# EAGLE design RAMPS_1-3i (EAGLE 6.4)
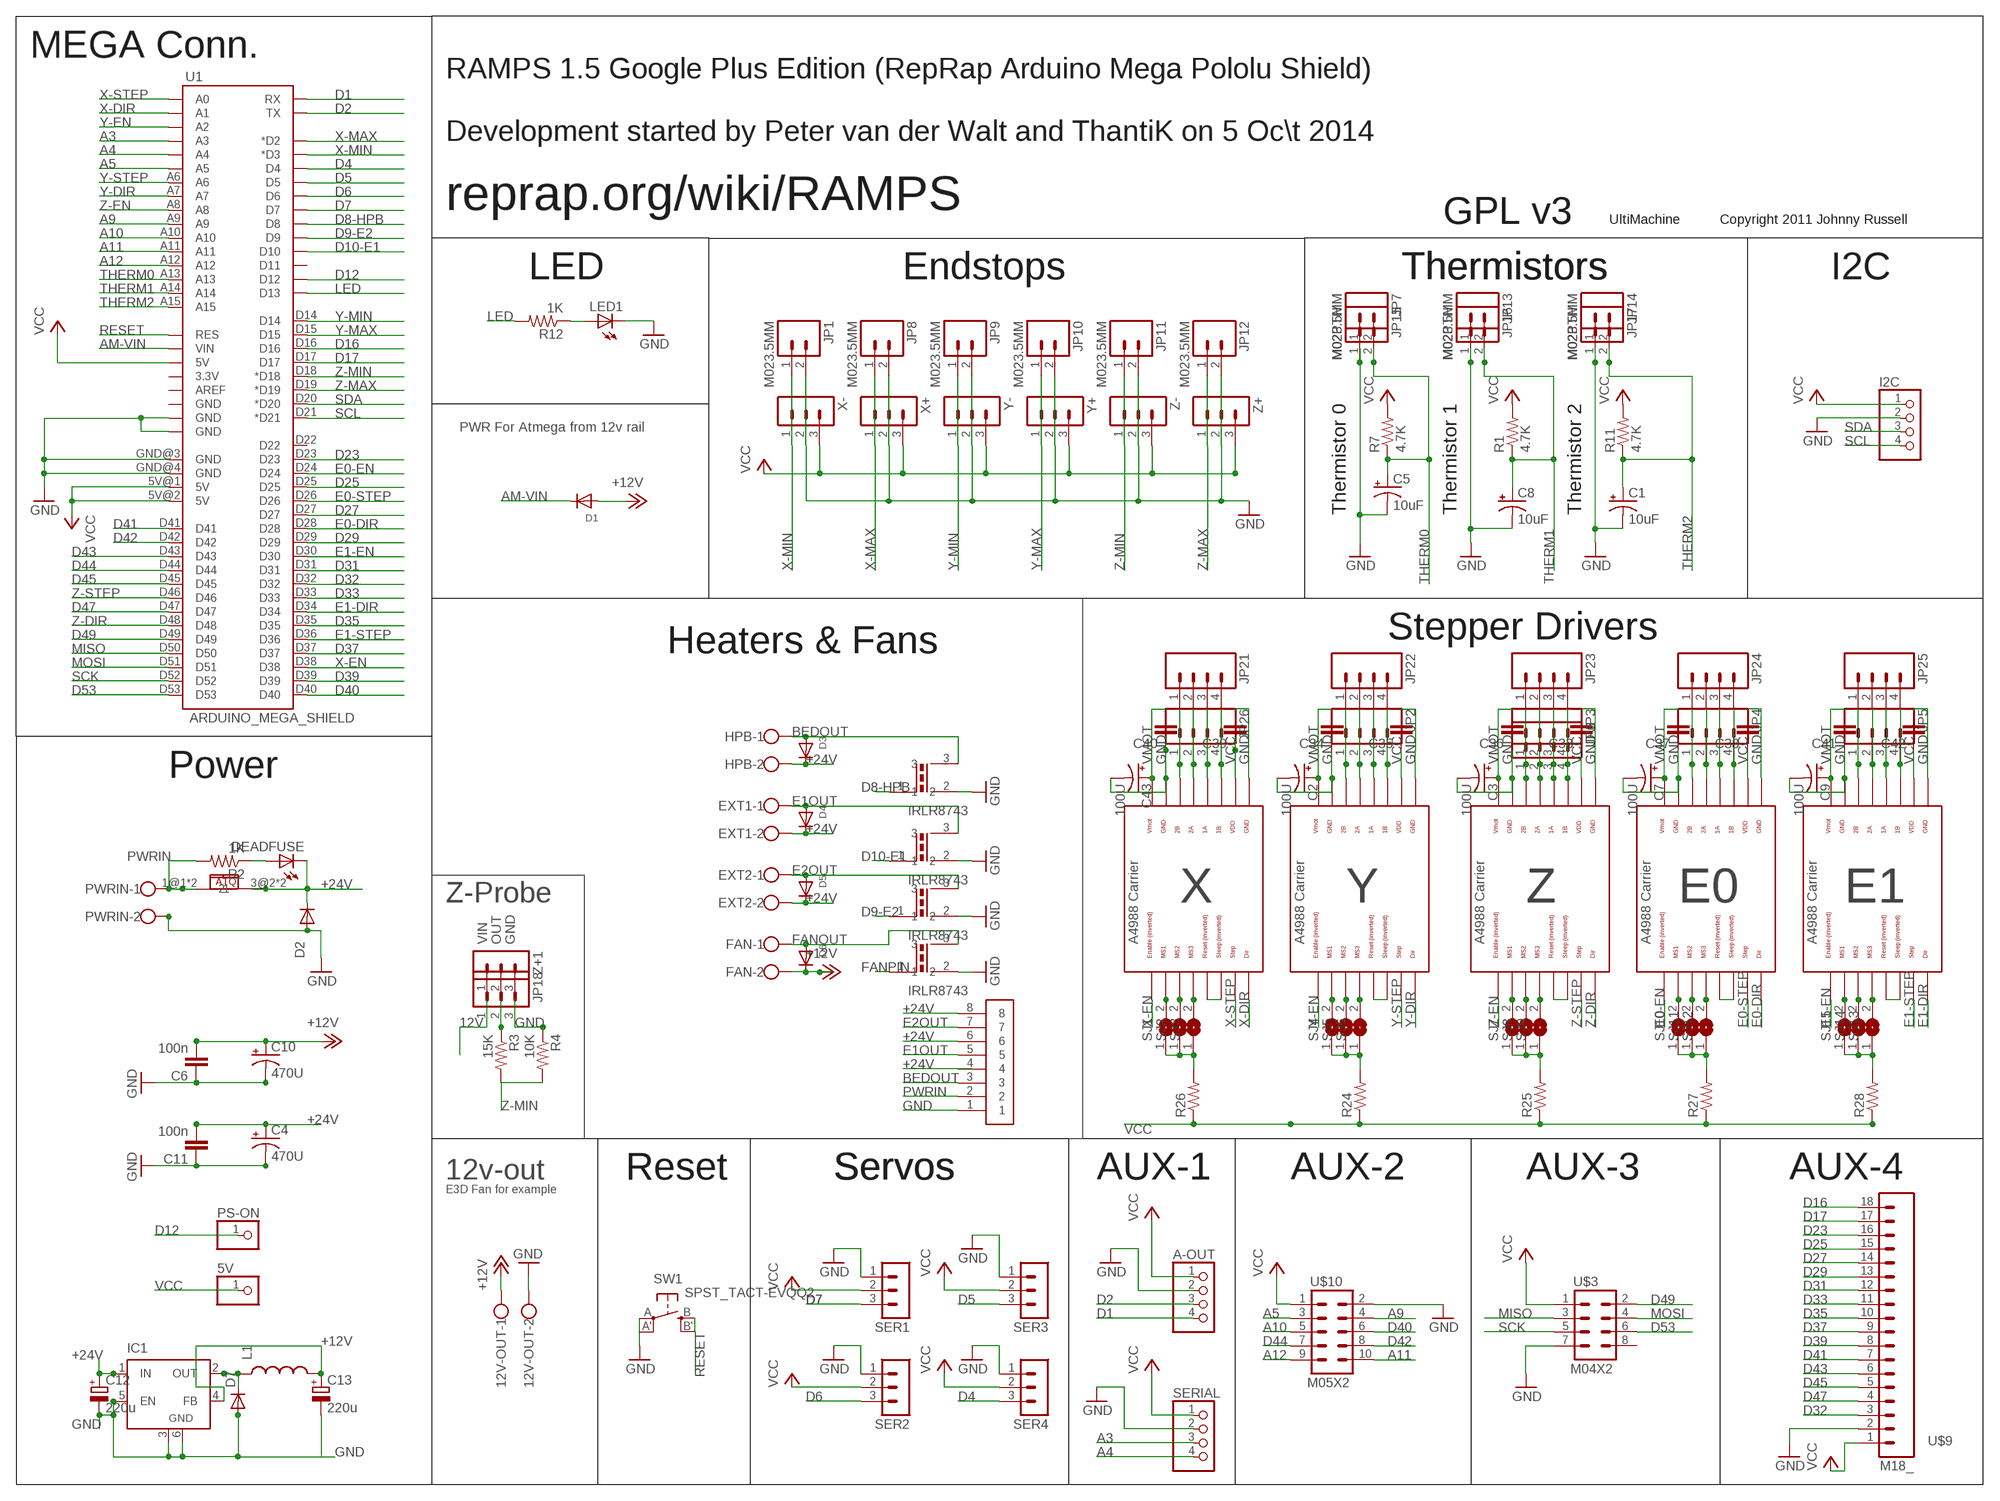
[diagram p0: schematic, sheet 1]

## Parts
5V  PINHD-1X1  [1X01]
12V-OUT  W237-102  [W237-102]
A-OUT  PINHD-1X4  [1X04]
C1  10uF  CPOL-USC  [PANASONIC_C]
C2  100U  CAP_POLD  [PANASONIC_D]
C3  100U  CAP_POLD  [PANASONIC_D]
C4  470U  CAP_POLD  [PANASONIC_D]
C5  10uF  CPOL-USC  [PANASONIC_C]
C6  100n  CAP1206  [1206]
C7  100U  CAP_POLD  [PANASONIC_D]
C8  10uF  CPOL-USC  [PANASONIC_C]
C9  100U  CAP_POLD  [PANASONIC_D]
C10  470U  CAP_POLD  [PANASONIC_D]
C11  100n  CAP1206  [1206]
C12  220u  CPOL-EU153CLV-0605  [153CLV-0605]
C13  220u  CPOL-EU153CLV-0605  [153CLV-0605]
C33  CAP1206  [1206]
C34  CAP1206  [1206]
C35  CAP1206  [1206]
C36  CAP1206  [1206]
C37  CAP1206  [1206]
C38  CAP1206  [1206]
C39  CAP1206  [1206]
C40  CAP1206  [1206]
C41  CAP1206  [1206]
C42  CAP1206  [1206]
C43  100U  CAP_POLD  [PANASONIC_D]
D1  DIODESMA  [SMADIODE]
D2  DIODESMA  [SMADIODE]
D3  DIODESMA  [SMADIODE]
D4  DIODESMA  [SMADIODE]
D5  DIODESMA  [SMADIODE]
D6  DIODESMA  [SMADIODE]
D7  DIODE-DO-214AC  [DO-214AC]
DEADFUSE  LEDCHIPLED_1206  [CHIPLED_1206]
E1POL1  POLOLU_A4983CARRIER  [A4988BREAKOUT]
E2POL1  POLOLU_A4983CARRIER  [A4988BREAKOUT]
EXT1  W237-102  [W237-102]
EXT2  W237-102  [W237-102]
FAN  W237-102  [W237-102]
HPB  W237-102  [W237-102]
I2C  PINHD-1X4  [1X04]
IC1  LM2596S  [TO263-5]
JP1  M023.5MM  [SCREWTERMINAL-3.5MM-2]
JP2  M04PTH  [1X04]
JP3  M04PTH  [1X04]
JP4  M04PTH  [1X04]
JP5  M04PTH  [1X04]
JP6  M04PTH  [1X04]
JP7  M023.5MM  [SCREWTERMINAL-3.5MM-2]
JP8  M023.5MM  [SCREWTERMINAL-3.5MM-2]
JP9  M023.5MM  [SCREWTERMINAL-3.5MM-2]
JP10  M023.5MM  [SCREWTERMINAL-3.5MM-2]
JP11  M023.5MM  [SCREWTERMINAL-3.5MM-2]
JP12  M023.5MM  [SCREWTERMINAL-3.5MM-2]
JP13  M023.5MM  [SCREWTERMINAL-3.5MM-2]
JP14  M023.5MM  [SCREWTERMINAL-3.5MM-2]
JP15  M02PTH  [1X02]
JP16  M02PTH  [1X02]
JP17  M02PTH  [1X02]
JP18  M03SCREW_LOCK  [SCREWTERMINAL-3.5MM-3_LOCK.007S]
JP21  M04SCREW  [SCREWTERMINAL-3.5MM-4]
JP22  M04SCREW  [SCREWTERMINAL-3.5MM-4]
JP23  M04SCREW  [SCREWTERMINAL-3.5MM-4]
JP24  M04SCREW  [SCREWTERMINAL-3.5MM-4]
JP25  M04SCREW  [SCREWTERMINAL-3.5MM-4]
JP26  M04PTH  [1X04]
L1  INDUCTORPWR  [CDRH125]
LED1  LED3MM  [LED3MM]
PS-ON  PINHD-1X1  [1X01]
PWRIN  W237-102  [W237-102]
R1  4.7K  R-US_M1206  [M1206]
R2  1K  R-US_M1206  [M1206]
R3  15K  R-US_M1206  [M1206]
R4  10K  R-US_M1206  [M1206]
R7  4.7K  R-US_M1206  [M1206]
R11  4.7K  R-US_M1206  [M1206]
R12  1K  R-US_M1206  [M1206]
R24  RESISTOR1206  [1206]
R25  RESISTOR1206  [1206]
R26  RESISTOR1206  [1206]
R27  RESISTOR1206  [1206]
R28  RESISTOR1206  [1206]
SER1  3PIN-HEADER  [3PIN-HEADER]
SER2  3PIN-HEADER  [3PIN-HEADER]
SER3  3PIN-HEADER  [3PIN-HEADER]
SER4  3PIN-HEADER  [3PIN-HEADER]
SERIAL  PINHD-1X4  [1X04]
SJ1  SJ  [SJ]
SJ2  SJ  [SJ]
SJ3  SJ  [SJ]
SJ4  SJ  [SJ]
SJ5  SJ  [SJ]
SJ6  SJ  [SJ]
SJ7  SJ  [SJ]
SJ8  SJ  [SJ]
SJ9  SJ  [SJ]
SJ10  SJ  [SJ]
SJ11  SJ  [SJ]
SJ12  SJ  [SJ]
SJ13  SJ  [SJ]
SJ14  SJ  [SJ]
SJ15  SJ  [SJ]
SW1  SPST_TACT-EVQQ2  [EVQ-Q2]
U1  ARDUINO_MEGA_SHIELD  [ARDUINO_MEGA_SHIELD]
U$1  IRLR8743  [TO263]
U$2  IRLR8743  [TO263]
U$3  M04X2  [2X4]
U$4  XY825A-8P  [XY825A-8P]
U$5  CQ-121  [CQ121]
U$9  M18_  [1X18]
U$10  M05X2  [2X5]
U$11  IRLR8743  [TO263]
U$12  IRLR8743  [TO263]
X+  3PIN-HEADER  [3PIN-HEADER]
X-  3PIN-HEADER  [3PIN-HEADER]
XPOL1  POLOLU_A4983CARRIER  [A4988BREAKOUT]
Y+  3PIN-HEADER  [3PIN-HEADER]
Y-  3PIN-HEADER  [3PIN-HEADER]
YPOL1  POLOLU_A4983CARRIER  [A4988BREAKOUT]
Z+  3PIN-HEADER  [3PIN-HEADER]
Z+1  3PIN-HEADER  [3PIN-HEADER]
Z-  3PIN-HEADER  [3PIN-HEADER]
ZPOL1  POLOLU_A4983CARRIER  [A4988BREAKOUT]

## Nets
12V: JP18.1 Z+1.1
+12V: 12V-OUT.1 C6.2 C10.+ C13.+ D1.A D6.C FAN.2 IC1.4(FB) L1.2
+24V: C4.+ C11.2 C12.+ D2.C D3.C D4.C D5.C DEADFUSE.C EXT1.2 EXT2.2 HPB.2 IC1.1(IN) U$4.6 U$4.8 U$5.3@2 U$5.4@2
A3: SERIAL.3 U1.A3
A4: SERIAL.4 U1.A4
A5: U1.A5 U$10.3
A9: U1.A9 U$10.4
A10: U1.A10 U$10.5
A11: U1.A11 U$10.10
A12: U1.A12 U$10.9
AM-VIN: D1.C U1.VIN
BEDOUT: D3.A HPB.1 U$2.3 U$4.3
D1: A-OUT.4 U1.RX
D2: A-OUT.3 U1.TX
D4: SER4.3 U1.D4
D5: SER3.3 U1.D5
D6: SER2.3 U1.D6
D7: SER1.3 U1.D7
D8-HPB: U1.D8 U$2.1
D9-E2: U1.D9 U$11.1
D10-E1: U1.D10 U$12.1
D12: PS-ON.1 U1.D12
D16: U1.D16 U$9.18
D17: U1.D17 U$9.17
D23: U1.D23 U$9.16
D25: U1.D25 U$9.15
D27: U1.D27 U$9.14
D29: U1.D29 U$9.13
D31: U1.D31 U$9.12
D32: U1.D32 U$9.3
D33: U1.D33 U$9.11
D35: U1.D35 U$9.10
D37: U1.D37 U$9.9
D39: U1.D39 U$9.8
D40: U1.D40 U$10.6
D41: U1.D41 U$9.7
D42: U1.D42 U$10.8
D43: U1.D43 U$9.6
D44: U1.D44 U$10.7
D45: U1.D45 U$9.5
D47: U1.D47 U$9.4
D49: U1.D49 U$3.2
D53: U1.D53 U$3.6
E0-DIR: E1POL1.DIR U1.D28
E0-EN: E1POL1.EN U1.D24
E0-STEP: E1POL1.STEP U1.D26
E1-DIR: E2POL1.DIR U1.D34
E1-EN: E2POL1.EN U1.D30
E1-STEP: E2POL1.STEP U1.D36
E1OUT: D4.A EXT1.1 U$4.5 U$12.3
E2OUT: D5.A EXT2.1 U$4.7 U$11.3
FANOUT: D6.A FAN.1 U$1.3
FANPIN: U$1.1
GND: 12V-OUT.2 A-OUT.2 C1.- C2.- C3.- C4.- C5.- C6.1 C7.- C8.- C9.- C10.- C11.1 C12.- C13.- C33.2 C34.1 C35.2 C36.1 C37.1 C38.2 C39.2 C40.1 C41.1 C42.2 C43.- D2.A D7.2(A) E1POL1.GND E1POL1.GND@0(GND) E2POL1.GND E2POL1.GND@0(GND) I2C.2 IC1.3(GND) IC1.5(EN) IC1.6(GND) JP1.2 JP7.1 JP8.2 JP9.2 JP10.2 JP11.2 JP12.2 JP13.1 JP14.1 JP15.1 JP16.1 JP17.1 JP18.3 LED1.K(C) PWRIN.2 R4.1 SER1.1 SER2.1 SER3.1 SER4.1 SERIAL.2 SW1.A'(P1) SW1.A(P) U1.GND@0(GND) U1.GND@1(GND) U1.GND@3(GND) U1.GND@4(GND) U$1.2 U$2.2 U$3.7 U$4.1 U$9.2 U$10.2 U$11.2 U$12.2 X+.2 X-.2 XPOL1.GND XPOL1.GND@0(GND) Y+.2 Y-.2 YPOL1.GND YPOL1.GND@0(GND) Z+1.3 Z+.2 Z-.2 ZPOL1.GND ZPOL1.GND@0(GND)
LED: R12.2 U1.D13
MISO: U1.D50 U$3.3
MOSI: U1.D51 U$3.4
N$1: D7.1(C) IC1.2(OUT) L1.1
N$3: DEADFUSE.A R2.1
N$4: SJ2.2 XPOL1.MS2
N$6: SJ1.2 XPOL1.MS1
N$7: SJ4.2 YPOL1.MS1
N$8: SJ5.2 YPOL1.MS2
N$9: SJ7.2 ZPOL1.MS1
N$10: SJ8.2 ZPOL1.MS2
N$11: SJ9.2 ZPOL1.MS3
N$12: SJ6.2 YPOL1.MS3
N$13: SJ3.2 XPOL1.MS3
N$14: E2POL1.MS2 SJ14.2
N$15: E2POL1.MS3 SJ13.2
N$16: E2POL1.MS1 SJ15.2
N$17: E1POL1.MS3 SJ12.2
N$18: E1POL1.MS1 SJ10.2
N$19: E1POL1.MS2 SJ11.2
N$46: LED1.A R12.1
N$52: E1POL1.RST E1POL1.SLP(SLEEP)
N$53: ZPOL1.RST ZPOL1.SLP(SLEEP)
N$56: YPOL1.RST YPOL1.SLP(SLEEP)
N$57: XPOL1.RST XPOL1.SLP(SLEEP)
N$58: R26.2 SJ1.1 SJ2.1 SJ3.1
N$59: R24.2 SJ4.1 SJ5.1 SJ6.1
N$60: R27.2 SJ10.1 SJ11.1 SJ12.1
N$62: R25.2 SJ7.1 SJ8.1 SJ9.1
N$63: E1POL1.1B JP4.4 JP24.4
N$65: E1POL1.1A JP4.3 JP24.3
N$68: E1POL1.2A JP4.2 JP24.2
N$69: E1POL1.2B JP4.1 JP24.1
N$70: JP3.4 JP6.4 JP23.4 ZPOL1.1B
N$71: JP3.3 JP6.3 JP23.3 ZPOL1.1A
N$72: JP3.2 JP6.2 JP23.2 ZPOL1.2A
N$74: JP3.1 JP6.1 JP23.1 ZPOL1.2B
N$75: JP2.1 JP22.1 YPOL1.2B
N$76: JP2.2 JP22.2 YPOL1.2A
N$77: JP2.3 JP22.3 YPOL1.1A
N$78: JP2.4 JP22.4 YPOL1.1B
N$79: JP21.4 JP26.4 XPOL1.1B
N$80: JP21.3 JP26.3 XPOL1.1A
N$81: JP21.2 JP26.2 XPOL1.2A
N$82: JP21.1 JP26.1 XPOL1.2B
N$83: E2POL1.RST E2POL1.SLP(SLEEP)
N$84: R28.2 SJ13.1 SJ14.1 SJ15.1
N$85: E2POL1.1B JP5.4 JP25.4
N$86: E2POL1.1A JP5.3 JP25.3
N$87: E2POL1.2A JP5.2 JP25.2
N$88: E2POL1.2B JP5.1 JP25.1
PWRIN: PWRIN.1 R2.2 U$4.2 U$5.1@1 U$5.2@1
RESET: SW1.B'(S1) SW1.B(S) U1.RES
SCK: U1.D52 U$3.5
SCL: I2C.4 U1.D21(*D21)
SDA: I2C.3 U1.D20(*D20)
SENSOROUT: JP18.2 R3.1 Z+1.2
THERM0: C5.+ JP7.2 JP15.2 R7.1 U1.A13
THERM1: C8.+ JP13.2 JP16.2 R1.1 U1.A14
THERM2: C1.+ JP14.2 JP17.2 R11.1 U1.A15
VCC: 5V.1 A-OUT.1 C33.1 C35.1 C38.1 C39.1 C42.1 E1POL1.VDD E2POL1.VDD I2C.1 R1.2 R7.2 R11.2 R24.1 R25.1 R26.1 R27.1 R28.1 SER1.2 SER2.2 SER3.2 SER4.2 SERIAL.1 U1.5V@0(5V) U1.5V@1(5V) U1.5V@2(5V) U$3.1 U$9.1 U$10.1 X+.3 X-.3 XPOL1.VDD Y+.3 Y-.3 YPOL1.VDD Z+.3 Z-.3 ZPOL1.VDD
VMOT: C2.+ C3.+ C7.+ C9.+ C34.2 C36.2 C37.2 C40.2 C41.2 C43.+ E1POL1.VMOT E2POL1.VMOT XPOL1.VMOT YPOL1.VMOT ZPOL1.VMOT
X-DIR: U1.A1 XPOL1.DIR
X-EN: U1.D38 XPOL1.EN
X-MAX: JP8.1 U1.D2(*D2) X+.1
X-MIN: JP1.1 U1.D3(*D3) X-.1
X-STEP: U1.A0 XPOL1.STEP
Y-DIR: U1.A7 YPOL1.DIR
Y-EN: U1.A2 YPOL1.EN
Y-MAX: JP10.1 U1.D15 Y+.1
Y-MIN: JP9.1 U1.D14 Y-.1
Y-STEP: U1.A6 YPOL1.STEP
Z-DIR: U1.D48 ZPOL1.DIR
Z-EN: U1.A8 ZPOL1.EN
Z-MAX: JP12.1 U1.D19(*D19) Z+.1
Z-MIN: JP11.1 R3.2 R4.2 U1.D18(*D18) Z-.1
Z-STEP: U1.D46 ZPOL1.STEP
Unconnected: U1.3.3V U1.AREF U1.D11 U1.D22 U1.GND@2(GND) U$3.8 U$4.4

## Notes on the sheet
- MEGA Conn.
- RAMPS 1.5 Google Plus Edition (RepRap Arduino Mega Pololu Shield)
  
  Development started by Peter van der Walt and ThantiK on 5 Oc\t 2014
- reprap.org/wiki/RAMPS
- GPL v3 | UltiMachine | Copyright 2011 Johnny Russell
- LED | Endstops | Thermistors | Thermistors | I2C
- PWR For Atmega from 12v rail
- Thermistor 0 | Thermistor 1 | Thermistor 2
- Stepper Drivers
- Heaters & Fans
- Power
- Z-Probe | X | Y | Z | E0 | E1
- VIN | OUT | GND
- 12v-out | Reset | Servos | Servos | AUX-1 | AUX-2 | AUX-3 | AUX-4
- E3D Fan for example

## Library data of the parts
5V PS-ON = adafruit:PINHD-1X1: Pin header 1x1 for 0.1" spacing With round pins
12V-OUT EXT1 EXT2 FAN HPB PWRIN = con-wago-500:W237-102: WAGO SCREW CLAMP; MPN: 237-102; OC_FARNELL: unknown; OC_NEWARK: 70K9898
A-OUT I2C SERIAL = RepRapjr:PINHD-1X4: PIN HEADER
C1 C5 C8 = adafruit:CPOL-US: POLARIZED CAPACITOR, American symbol
C2-C4 C7 C9 C10 C43 = SparkFun-Capacitors:CAP_POL: Capacitor Polarized These are standard SMD and PTH capacitors. Normally 10uF, 47uF, and 100uF in electrolytic and tantalum varieties. Always verify the external diameter of the through hole cap, it varies with capacity, voltage, and manufacturer. The EIA devices should be standard.
C6 C11 C33-C42 = SparkFun-Passives:CAP: Capacitor Standard 0603 ceramic capacitor, and 0.1" leaded capacitor.
C12 C13 = rcl:CPOL-EU: POLARIZED CAPACITOR, European symbol
D1-D6 = adafruit:DIODE: Diode SMADIODE - SMA Surface Mount Package 20V 1A Schottky Diode Digikey: 641-1014-6-ND DO-1N4148 - Through Hole Small Current Diode SOD-123 20V 1 A (.5mV Vf) Schottky Diode - Digikey: MBRX120TPMSCT-ND SOD-323 10V 570mA (.38mV Vf, 3ns) Schottky Diode - Digikey: ZLLS410CT-ND SOD-523 30V 30mA Schottky Diode (RB751S-40TE61) - Digikey: RB751S-40TE61CT-ND SOT23-R/W - SOT23 Package (R = Solder Paste/Reflow Ovens, W = Hand-Soldering) BAT54Film 40V 300mA - Digikey: 497-7162-1-ND
D7 = dp_devices:DIODE: Various Diode Packages
DEADFUSE LED1 = led:LED: LED OSRAM: - CHIPLED LG R971, LG N971, LY N971, LG Q971, LY Q971, LO R971, LY R971 LH N974, LH R974 LS Q976, LO Q976, LY Q976 LO Q996 - Hyper CHIPLED LW Q18S LB Q993, LB Q99A, LB R99A - SideLED LS A670, LO A670, LY A670, LG A670, LP A670 LB A673, LV A673, LT A673, LW A673 LH A674 LY A675 LS A676, LA A676, LO A676, LY A676, LW A676 LS A679, LY A679, LG A679 - Hyper Micro SIDELED® LS Y876, LA Y876, LO Y876, LY Y876 LT Y87S - SmartLED LW L88C, LW L88S LB L89C, LB L89S, LG L890 LS L89K, LO L89K, LY L89K LS L896, LA L896, LO L896, LY L896 - TOPLED LS T670, LO T670, LY T670, LG T670, LP T670 LSG T670, LSP T670, LSY T670, LOP T670, LYG T670 LG T671, LOG T671, LSG T671 LB T673, LV T673, LT T673, LW T673 LH T674 LS T676, LA T676, LO T676, LY T676, LB T676, LH T676, LSB T676, LW T676 LB T67C, LV T67C, LT T67C, LS T67K, LO T67K, LY T67K, LW E67C LS E67B, LA E67B, LO E67B, LY E67B, LB E67C, LV E67C, LT E67C LW T67C LS T679, LY T679, LG T679 LS T770, LO T770, LY T770, LG T770, LP T770 LB T773, LV T773, LT T773, LW T773 LH T774 LS E675, LA E675, LY E675, LS T675 LS T776, LA T776, LO T776, LY T776, LB T776 LHGB T686 LT T68C, LB T68C - Hyper Mini TOPLED® LB M676 - Mini TOPLED Santana® LG M470 LS M47K, LO M47K, LY M47K Source: http://www.osram.convergy.de LUXEON: - LUMILED® LXK2-PW12-R00, LXK2-PW12-S00, LXK2-PW14-U00, LXK2-PW14-V00 LXK2-PM12-R00, LXK2-PM12-S00, LXK2-PM14-U00 LXK2-PE12-Q00, LXK2-PE12-R00, LXK2-PE12-S00, LXK2-PE14-T00, LXK2-PE14-U00 LXK2-PB12-K00, LXK2-PB12-L00, LXK2-PB12-M00, LXK2-PB14-N00, LXK2-PB14-P00, LXK2-PB14-Q00 LXK2-PR12-L00, LXK2-PR12-M00, LXK2-PR14-Q00, LXK2-PR14-R00 LXK2-PD12-Q00, LXK2-PD12-R00, LXK2-PD12-S00 LXK2-PH12-R00, LXK2-PH12-S00 LXK2-PL12-P00, LXK2-PL12-Q00, LXK2-PL12-R00 Source: www.luxeon.com KINGBRIGHT: KA-3528ASYC Source: www.kingbright.com
E1POL1 E2POL1 XPOL1 YPOL1 ZPOL1 = RepRapjr:POLOLU_A4983CARRIER
IC1 = linear:LM2596S: STEP-DOWN VOLTAGE REGULATOR
JP1 JP7-JP17 = SparkFun-Connectors:M02: Standard 2-pin 0.1" header. Use with - straight break away headers ( PRT-00116) - right angle break away headers (PRT-00553) - swiss pins (PRT-00743) - machine pins (PRT-00117) - female headers (PRT-00115) Molex polarized connector foot print use with: PRT-08233 with associated crimp pins and housings. 2.54_SCREWTERM for use with PRT-10571. 3.5mm Screw Terminal footprints for PRT-08084 5mm Screw Terminal footprints for use with PRT-08432
JP2-JP6 JP21-JP26 = SparkFun-Connectors:M04: Header 4 Standard 4-pin 0.1" header. Use with straight break away headers (SKU : PRT-00116), right angle break away headers (PRT-00553), swiss pins (PRT-00743), machine pins (PRT-00117), and female headers (PRT-00115). Molex polarized connector foot print use with SKU : PRT-08231 with associated crimp pins and housings. 1MM SMD Version SKU: PRT-10208
JP18 = SparkFun-Connectors:M03: Header 3 Standard 3-pin 0.1" header. Use with straight break away headers (SKU : PRT-00116), right angle break away headers (PRT-00553), swiss pins (PRT-00743), machine pins (PRT-00117), and female headers (PRT-00115). Molex polarized connector foot print use with SKU : PRT-08232 with associated crimp pins and housings.
L1 = SparkFun-Passives:INDUCTOR: Inductors Basic Inductor/Choke - 0603 and 1206. Footprints are not proven and vary greatly between part numbers. SRN6045- 33uH, 20% 1.4A SDR0403-560KL - 56uH, 10%, 500mA RMS/740mA peak
R1-R4 R7 R11 R12 = adafruit:R-US_: RESISTOR, American symbol
R24-R28 = SparkFun-Passives:RESISTOR: Resistor Basic schematic elements and footprints for 0603, 1206, and PTH resistors.
SER1-SER4 X+ X- Y+ Y- Z+ Z+1 Z- = ultimachine:3PIN-HEADER: PIN HEADER
SJ1-SJ15 = jumper:SJ: SMD solder JUMPER
SW1 = adafruit:SPST_TACT: SMT 6mm switch, EVQQ2 series http://www.ladyada.net/library/eagle
U1 = RepRapjr:ARDUINO_MEGA_SHIELD
U$1 U$2 U$11 U$12 = IRLR8743:IRLR8743
U$3 = SparkFun:M04X2
U$4 = Communica.co.za:XY825A-8P
U$5 = Mantech.co.za:CQ-121
U$9 = SparkFun:M18
U$10 = RepRapjr:M05X2

## Net classes
0 default: width 0.254 mm, clearance 0.254 mm

## Board
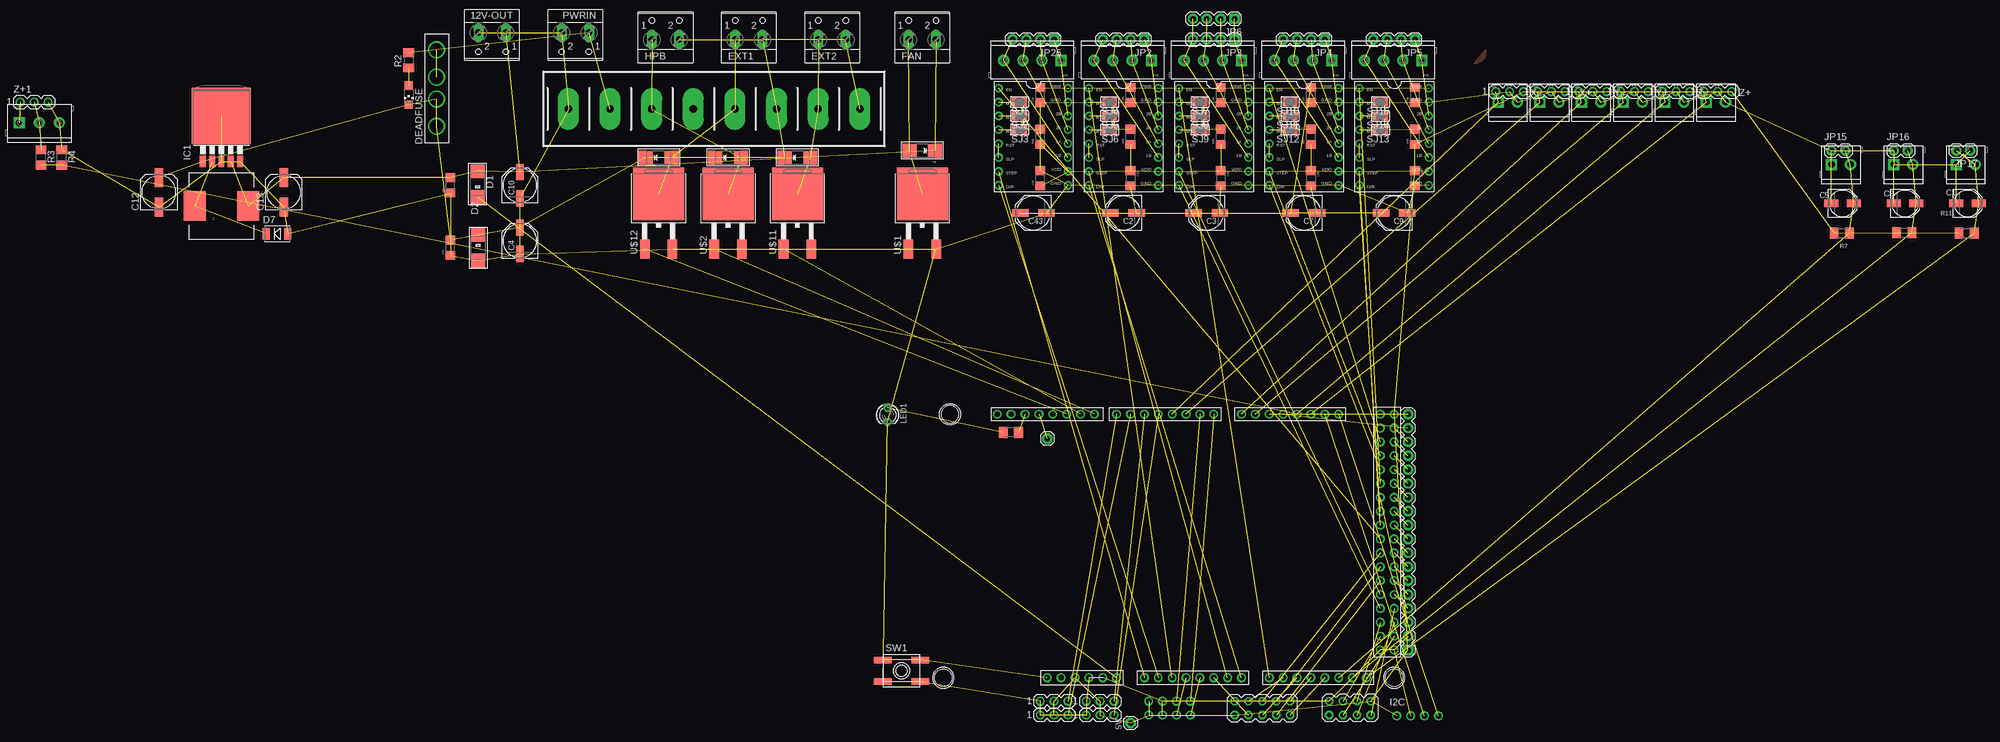
[diagram p1: board, top side]
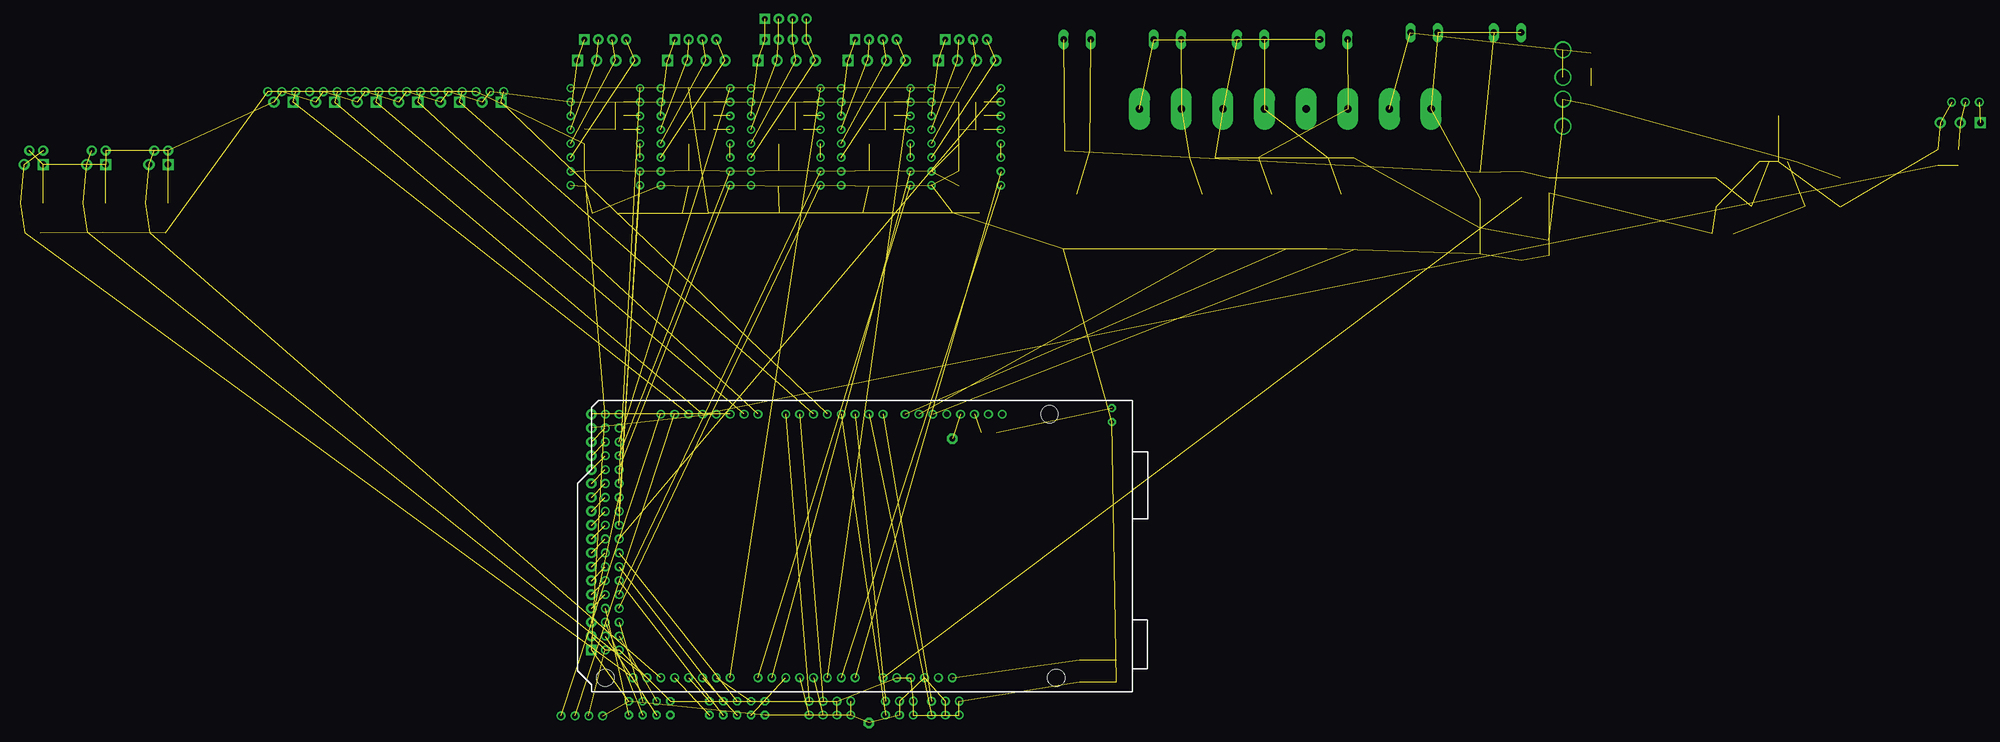
[diagram p2: board, bottom side, seen from below]

No outline drawn. Coordinates in mm, seen from the top.
Copper layers (1*16): Top 0.035mm / dielectric 1.5mm / Bottom 0.035mm
Design rules "ramps1-3 *": minimum track width 7mil, minimum drill 15mil, track to track 7mil, track to pad 7mil, pad to pad 7mil, via to via 7mil, smd to smd 7mil, copper to edge 10mil, drill to drill 8mil, minimum pad ring 12mil, minimum via ring 12mil, stop-mask expansion 4mil, vias tented up to drill 25mil, thermal gap 10mil

### Footprints (pad centres in the part's own frame; a part is rotated, then mirrored left to right if it is on the bottom)
1X01 = drill 1.016 pad 1.93 octagon: 1 0,0
W237-102 = drill 1.194 long: 1 -2.5,-1.27; 2 2.5,-1.27
1X04 = drill 1.016: 1 -2.54,0; 2 0,0; 3 2.54,0; 4 5.08,0
PANASONIC_C = smd 2.6 x 1.4: + 2.05,0; - -2.05,0
PANASONIC_D = smd 3 x 1.4: + 2.4,0; - -2.4,0
1206 = smd 1.6 x 1.8: 1 -1.4,0; 2 1.4,0
153CLV-0605 = smd 3.5 x 1.6: + 2.7,0; - -2.7,0
SMADIODE = smd 2.54 x 2.54: A 2.349,0; C -2.349,0
DO-214AC = smd 1.27 x 2.1: 1 -1.98,0; 2 1.98,0
CHIPLED_1206 = smd 1.5 x 1.5: A 0,-1.75; C 0,1.75
A4988BREAKOUT = drill 0.9: 1A 8.89,1.27; 1B 11.43,1.27; 2A 6.35,1.27; 2B 3.81,1.27; DIR 16.51,-11.43; EN -1.27,-11.43; GND 16.51,1.27; GND@0 1.27,1.27; MS1 1.27,-11.43; MS2 3.81,-11.43; MS3 6.35,-11.43; RST 8.89,-11.43; SLP 11.43,-11.43; STEP 13.97,-11.43; VDD 13.97,1.27; VMOT -1.27,1.27
TO263-5 = smd 1.067 x 2.159: 1 -3.404,-5.791; 2 -1.702,-5.791; 3 0,-5.791; 4 1.702,-5.791; 5 3.404,-5.791 | smd 10.8 x 10.41: 6 0,2.54
SCREWTERMINAL-3.5MM-2 = drill 1.2 pad 2.032 square: 1 0,0 | drill 1.2 pad 2.032: 2 3.5,0
1X04' = drill 1.016 pad 1.88 square: 1 0,0 | drill 1.016 pad 1.88: 2 2.54,0; 3 5.08,0; 4 7.62,0
1X02 = drill 1.016 pad 1.88: 1 0,0; 2 2.54,0
SCREWTERMINAL-3.5MM-3_LOCK.007S = drill 1.2 pad 2.032 square: 1 -0.178,0 | drill 1.2 pad 2.032: 2 3.5,0; 3 7.178,0
SCREWTERMINAL-3.5MM-4 = drill 1.2 pad 2.032 square: 1 0,0 | drill 1.2 pad 2.032: 2 3.5,0; 3 7,0; 4 10.5,0
CDRH125 = smd 5.4 x 4: 1 0,4.9; 2 0,-4.9
LED3MM = drill 0.813 octagon: A -1.27,0; K 1.27,0
M1206 = smd 1.6 x 2: 1 -1.4,0; 2 1.4,0
3PIN-HEADER = drill 1.016: 1 -2.54,0; 2 0,0; 3 2.54,0
SJ = smd 1.168 x 1.6: 1 -0.762,0; 2 0.762,0
EVQ-Q2 = smd 3.2 x 1.2: A -3.4,-2; A' 3.4,-2; B -3.4,2; B' 3.4,2
ARDUINO_MEGA_SHIELD = drill 1 pad 1.422: 3.3V 35.56,2.54; 5V@0 38.1,2.54; 5V@1 93.98,50.8; 5V@2 96.52,50.8; A0 50.8,2.54; A1 53.34,2.54; A2 55.88,2.54; A3 58.42,2.54; A4 60.96,2.54; A5 63.5,2.54; A6 66.04,2.54; A7 68.58,2.54; A8 73.66,2.54; A9 76.2,2.54; A10 78.74,2.54; A11 81.28,2.54; A12 83.82,2.54; A13 86.36,2.54; A14 88.9,2.54; A15 91.44,2.54; AREF 23.876,50.8; D2 58.42,50.8; D3 55.88,50.8; D4 53.34,50.8; D5 50.8,50.8; D6 48.26,50.8; D7 45.72,50.8; D8 41.656,50.8; D9 39.116,50.8; D10 36.576,50.8; D11 34.036,50.8; D12 31.496,50.8; D13 28.956,50.8; D14 68.58,50.8; D15 71.12,50.8; D16 73.66,50.8; D17 76.2,50.8; D18 78.74,50.8; D19 81.28,50.8; D20 83.82,50.8; D21 86.36,50.8; D22 93.98,48.26; D23 96.52,48.26; D24 93.98,45.72; D25 96.52,45.72; D26 93.98,43.18; D27 96.52,43.18; D28 93.98,40.64; D29 96.52,40.64; D30 93.98,38.1; D31 96.52,38.1; D32 93.98,35.56; D33 96.52,35.56; D34 93.98,33.02; D35 96.52,33.02; D36 93.98,30.48; D37 96.52,30.48; D38 93.98,27.94; D39 96.52,27.94; D40 93.98,25.4; D41 96.52,25.4; D42 93.98,22.86; D43 96.52,22.86; D44 93.98,20.32; D45 96.52,20.32; D46 93.98,17.78; D47 96.52,17.78; D48 93.98,15.24; D49 96.52,15.24; D50 93.98,12.7; D51 96.52,12.7; D52 93.98,10.16; D53 96.52,10.16; GND@0 40.64,2.54; GND@1 43.18,2.54; GND@2 26.416,50.8; GND@3 93.98,7.62; GND@4 96.52,7.62; RES 33.02,2.54; RX 63.5,50.8; TX 60.96,50.8; VIN 45.72,2.54 | hole 3.2: 96.52,2.54; 13.97,2.54; 15.24,50.8
TO263 = smd 1.762 x 3.4: 1 -2.54,-6.6; 2 2.54,-6.6 | smd 9.34 x 9.6: 3 0,3.5
2X4 = drill 0.9 pad 1.422 octagon: 1 -3.81,-1.27; 2 -3.81,1.27; 3 -1.27,-1.27; 4 -1.27,1.27; 5 1.27,-1.27; 6 1.27,1.27; 7 3.81,-1.27; 8 3.81,1.27
XY825A-8P = drill 1.3 pad 3.81 long: 1 -26.67,0; 2 -19.05,0; 3 -11.43,0; 4 -3.81,0; 5 3.81,0; 6 11.43,0; 7 19.05,0; 8 26.67,0
CQ121 = drill 2.5: 1@1 -7,0; 2@1 -2,0; 3@2 2,0; 4@2 7,0
1X18 = drill 1.016 pad 1.88 square: 1 0,0 | drill 1.016 pad 1.88: 2 2.54,0; 3 5.08,0; 4 7.62,0; 5 10.16,0; 6 12.7,0; 7 15.24,0; 8 17.78,0; 9 20.32,0; 10 22.86,0; 11 25.4,0; 12 27.94,0; 13 30.48,0; 14 33.02,0; 15 35.56,0; 16 38.1,0; 17 40.64,0; 18 43.18,0
2X5 = drill 0.9 pad 1.422 octagon: 1 -3.81,-1.27; 2 -3.81,1.27; 3 -1.27,-1.27; 4 -1.27,1.27; 5 1.27,-1.27; 6 1.27,1.27; 7 3.81,-1.27; 8 3.81,1.27; 9 6.35,-1.27; 10 6.35,1.27

### Placement (x,y rotation side)
5V  -66.04,8.23 0 top
12V-OUT  -182.88,133.35 180 top
A-OUT  -60.17,12.22 0 top
C1  87.15,103.38 0 top
C2  -67.31,101.6 180 top
C3  -52.07,101.6 180 top
C4  -177.8,96.52 90 top
C5  64.29,103.38 0 top
C6  -190.5,106.68 90 top
C7  -34.29,101.6 180 top
C8  75.72,103.38 0 top
C9  -17.78,101.6 180 top
C10  -177.8,106.68 90 top
C11  -190.5,95.25 90 top
C12  -243.84,105.41 90 top
C13  -220.98,105.41 90 top
C33  -49.53,107.95 270 top
C34  -66.04,123.19 90 top
C35  -66.04,107.95 270 top
C36  -13.97,123.19 90 top
C37  -33.02,123.19 90 top
C38  -13.97,107.95 270 top
C39  -33.02,107.95 270 top
C40  -49.53,123.19 90 top
C41  -82.55,123.19 90 top
C42  -82.55,107.95 90 top
C43  -83.82,101.6 180 top
D1  -185.53,106.88 90 top
D2  -185.42,95.25 270 top
D3  -139.7,111.76 0 top
D4  -152.4,111.76 0 top
D5  -127,111.76 0 top
D6  -104.14,113.03 180 top
D7  -222.25,97.79 0 top
DEADFUSE  -198.12,123.19 180 top
E1POL1  -29.21,123.19 270 top
E2POL1  -12.7,123.19 270 top
EXT1  -135.89,134.62 0 top
EXT2  -120.65,134.62 0 top
FAN  -104.14,134.62 0 top
HPB  -151.13,134.62 0 top
I2C  -14.76,9.53 0 top
IC1  -232.41,116.84 0 top
JP1  1.27,121.92 0 top
JP2  [1X04']  -63.5,133.35 180 top
JP3  [1X04']  -46.99,133.35 180 top
JP4  [1X04']  -30.48,133.35 180 top
JP5  [1X04']  -13.97,133.35 180 top
JP6  [1X04']  -46.99,137.16 180 top
JP7  62.23,110.49 0 top
JP8  8.89,121.92 0 top
JP9  16.51,121.92 0 top
JP10  24.13,121.92 0 top
JP11  31.75,121.92 0 top
JP12  39.37,121.92 0 top
JP13  73.66,110.49 0 top
JP14  85.09,110.49 0 top
JP15  62.23,113.03 0 top
JP16  73.66,113.03 0 top
JP17  87.63,113.03 180 top
JP18  -269.24,118.11 0 top
JP21  -78.74,129.54 180 top
JP22  -62.23,129.54 180 top
JP23  -45.72,129.54 180 top
JP24  -29.21,129.54 180 top
JP25  -12.7,129.54 180 top
JP26  [1X04']  -80.01,133.35 180 top
L1  -232.41,102.87 90 top
LED1  -110.49,64.61 270 top
PS-ON  -81.28,60.3 0 top
PWRIN  -167.64,133.35 180 top
R1  75.56,98 180 top
R2  -198.12,129.54 90 top
R3  -265.43,111.76 270 top
R4  -261.62,111.76 270 top
R7  64.14,97.9 180 top
R11  87,97.95 180 top
R12  -87.95,61.44 0 top
R24  -66.04,115.57 90 top
R25  -49.53,115.57 90 top
R26  -82.55,115.57 90 top
R27  -33.02,115.57 90 top
R28  -13.97,115.57 90 top
SER1  -80.01,12.22 0 top
SER2  -80.01,9.68 0 top
SER3  -71.6,12.22 0 top
SER4  -71.6,9.68 0 top
SERIAL  -60.17,9.68 0 top
SJ1  -86.36,121.92 180 top
SJ2  -86.36,119.38 180 top
SJ3  -86.36,116.84 180 top
SJ4  -69.85,121.92 180 top
SJ5  -69.85,119.38 180 top
SJ6  -69.85,116.84 180 top
SJ7  -53.34,121.92 180 top
SJ8  -53.34,119.38 180 top
SJ9  -53.34,116.84 180 top
SJ10  -36.83,121.92 180 top
SJ11  -36.83,119.38 180 top
SJ12  -36.83,116.84 180 top
SJ13  -20.32,116.84 180 top
SJ14  -20.32,119.38 180 top
SJ15  -20.32,121.92 180 top
SW1  -107.95,17.78 0 top
U1  -114.3,13.97 0 top
U$1  -104.14,101.6 0 top
U$2  -139.7,101.6 0 top
U$3  -25.88,10.95 180 top
U$4  -142.24,120.65 0 top
U$5  -193.04,124.46 270 top
U$9  -15.24,21.59 90 top
U$10  -43.18,10.95 0 top
U$11  -127,101.6 0 top
U$12  -152.4,101.6 0 top
X+  10.95,123.83 0 top
X-  3.33,123.83 0 top
XPOL1  -78.74,123.19 270 top
Y+  26.19,123.83 0 top
Y-  18.57,123.83 0 top
YPOL1  -62.23,123.19 270 top
Z+  41.43,123.83 0 top
Z+1  -266.7,121.92 0 top
Z-  33.81,123.83 0 top
ZPOL1  -45.72,123.19 270 top

### Tracks (layer width: path | path; a pad name or v marks a point on that pad's centre or on a via)
5V
  pour Top: -0.98,131.48 -0.98,131.16 arc-90 -3.21,128.94
12V  (1 unrouted)
+12V  (8 unrouted)
+24V  (15 unrouted)
A3  (1 unrouted)
A4  (1 unrouted)
A5  (1 unrouted)
A9  (1 unrouted)
A10  (1 unrouted)
A11  (1 unrouted)
A12  (1 unrouted)
AM-VIN  (1 unrouted)
BEDOUT  (3 unrouted)
D1  (1 unrouted)
D2  (1 unrouted)
D4  (1 unrouted)
D5  (1 unrouted)
D6  (1 unrouted)
D7  (1 unrouted)
D8-HPB  (1 unrouted)
D9-E2  (1 unrouted)
D10-E1  (1 unrouted)
D12  (1 unrouted)
D16  (1 unrouted)
D17  (1 unrouted)
D23  (1 unrouted)
D25  (1 unrouted)
D27  (1 unrouted)
D29  (1 unrouted)
D31  (1 unrouted)
D32  (1 unrouted)
D33  (1 unrouted)
D35  (1 unrouted)
D37  (1 unrouted)
D39  (1 unrouted)
D40  (1 unrouted)
D41  (1 unrouted)
D42  (1 unrouted)
D43  (1 unrouted)
D44  (1 unrouted)
D45  (1 unrouted)
D47  (1 unrouted)
D49  (1 unrouted)
D53  (1 unrouted)
E0-DIR  (1 unrouted)
E0-EN  (1 unrouted)
E0-STEP  (1 unrouted)
E1-DIR  (1 unrouted)
E1-EN  (1 unrouted)
E1-STEP  (1 unrouted)
E1OUT  (3 unrouted)
E2OUT  (3 unrouted)
FANOUT  (2 unrouted)
GND  (83 unrouted)
LED  (1 unrouted)
MISO  (1 unrouted)
MOSI  (1 unrouted)
N$1  (2 unrouted)
N$3  (1 unrouted)
N$4  (1 unrouted)
N$6  (1 unrouted)
N$7  (1 unrouted)
N$8  (1 unrouted)
N$9  (1 unrouted)
N$10  (1 unrouted)
N$11  (1 unrouted)
N$12  (1 unrouted)
N$13  (1 unrouted)
N$14  (1 unrouted)
N$15  (1 unrouted)
N$16  (1 unrouted)
N$17  (1 unrouted)
N$18  (1 unrouted)
N$19  (1 unrouted)
N$46  (1 unrouted)
N$52  (1 unrouted)
N$53  (1 unrouted)
N$56  (1 unrouted)
N$57  (1 unrouted)
N$58  (3 unrouted)
N$59  (3 unrouted)
N$60  (3 unrouted)
N$62  (3 unrouted)
N$63  (2 unrouted)
N$65  (2 unrouted)
N$68  (2 unrouted)
N$69  (2 unrouted)
N$70  (3 unrouted)
N$71  (3 unrouted)
N$72  (3 unrouted)
N$74  (3 unrouted)
N$75  (2 unrouted)
N$76  (2 unrouted)
N$77  (2 unrouted)
N$78  (2 unrouted)
N$79  (2 unrouted)
N$80  (2 unrouted)
N$81  (2 unrouted)
N$82  (2 unrouted)
N$83  (1 unrouted)
N$84  (3 unrouted)
N$85  (2 unrouted)
N$86  (2 unrouted)
N$87  (2 unrouted)
N$88  (2 unrouted)
PWRIN  (4 unrouted)
RESET  (2 unrouted)
SCK  (1 unrouted)
SCL  (1 unrouted)
SDA  (1 unrouted)
SENSOROUT  (2 unrouted)
THERM0  (4 unrouted)
THERM1  (4 unrouted)
THERM2  (4 unrouted)
VCC  (37 unrouted)
VMOT  (14 unrouted)
X-DIR  (1 unrouted)
X-EN  (1 unrouted)
X-MAX  (2 unrouted)
X-MIN  (2 unrouted)
X-STEP  (1 unrouted)
Y-DIR  (1 unrouted)
Y-EN  (1 unrouted)
Y-MAX  (2 unrouted)
Y-MIN  (2 unrouted)
Y-STEP  (1 unrouted)
Z-DIR  (1 unrouted)
Z-EN  (1 unrouted)
Z-MAX  (2 unrouted)
Z-MIN  (4 unrouted)
Z-STEP  (1 unrouted)

### Text on the board
Document: Z-Probe | 24-12v SMPS | Pwr, Mosfets, Fuse, Fuse-dead-LED | Stepper Drivers | ENDSTOPS | Thermistors | therm0 | therm1 | therm2 | x | Y | Z | E0 | E1 | xmin | xmax | ymin | ymax | zmin | zmax | To-Do / / Add switchmode converter to feed 12v rail / Request: Add small FDC8886's to switch 12v for other fans, LEDs, etc / If space left over investigate PT100s | Done: / / Added FAN Mosfet / Added 12v RAIL (TODO: Switchmode from 24v) / Added fuse with blown indicator LED / Added 3.5mm screw terminals in parallel to 0.1" headers for motors, endstops, thermistors / Added D size SMD caps (63v) to VMOTOR for each driver / Added D size SMD cap for 470u on 12v rail / Changed Thermistor to C-Type SMD 10u Caps and 1206 4k7 Resistors / Kept original servo and expansion headers in exactly same place they were / Switched Reset button to normal 6x6 variant not the 90deg that was on the board / Switched mosfets to proper logic level IRLB8743 in SMD type / Design 24v rail / Add Z Probe circuitry / Add flyback diodes on MOSFETs for safety / Add back SJ's for Microstepping / Find proper terminals (Communica.co.za XY825A-8P) for high current connections - parallel footprint with 5mm screw terminals / Fix footprint for fuse to correct ATQ Automotive fuse (CQ-121 type)